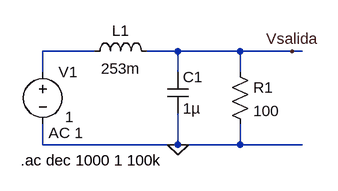
[diagram p0: schematic Punto 1.asc]
Punto 1.asc, the LTspice schematic file:
Version 4
SHEET 1 880 680
WIRE 64 96 -16 96
WIRE 192 96 144 96
WIRE 288 96 192 96
WIRE 368 96 288 96
WIRE 384 96 368 96
WIRE -16 128 -16 96
WIRE 192 128 192 96
WIRE 288 128 288 96
WIRE -16 240 -16 208
WIRE 192 240 192 192
WIRE 192 240 -16 240
WIRE 288 240 288 208
WIRE 288 240 192 240
WIRE 384 240 288 240
FLAG 192 240 0
FLAG 368 96 Vsalida
SYMBOL voltage -16 112 R0
WINDOW 3 34 85 Left 2
WINDOW 123 9 110 Left 2
WINDOW 39 0 0 Left 0
SYMATTR InstName V1
SYMATTR Value 1
SYMATTR Value2 AC 1
SYMBOL ind 48 112 R270
WINDOW 0 32 56 VTop 2
WINDOW 3 5 56 VBottom 2
SYMATTR InstName L1
SYMATTR Value 253m
SYMBOL cap 176 128 R0
SYMATTR InstName C1
SYMATTR Value 1µ
SYMBOL res 272 112 R0
SYMATTR InstName R1
SYMATTR Value 100
TEXT -50 264 Left 2 !.ac dec 1000 1 100k

The netlist it stands for:
* Punto 1.asc
V1 N001 0 1 AC 1
L1 N001 Vsalida 253m
C1 Vsalida 0 1µ
R1 Vsalida 0 100
.ac dec 1000 1 100k
.backanno
.end